# Altium schematic sheet Gate Driver Rectifier.SchDoc
size A4
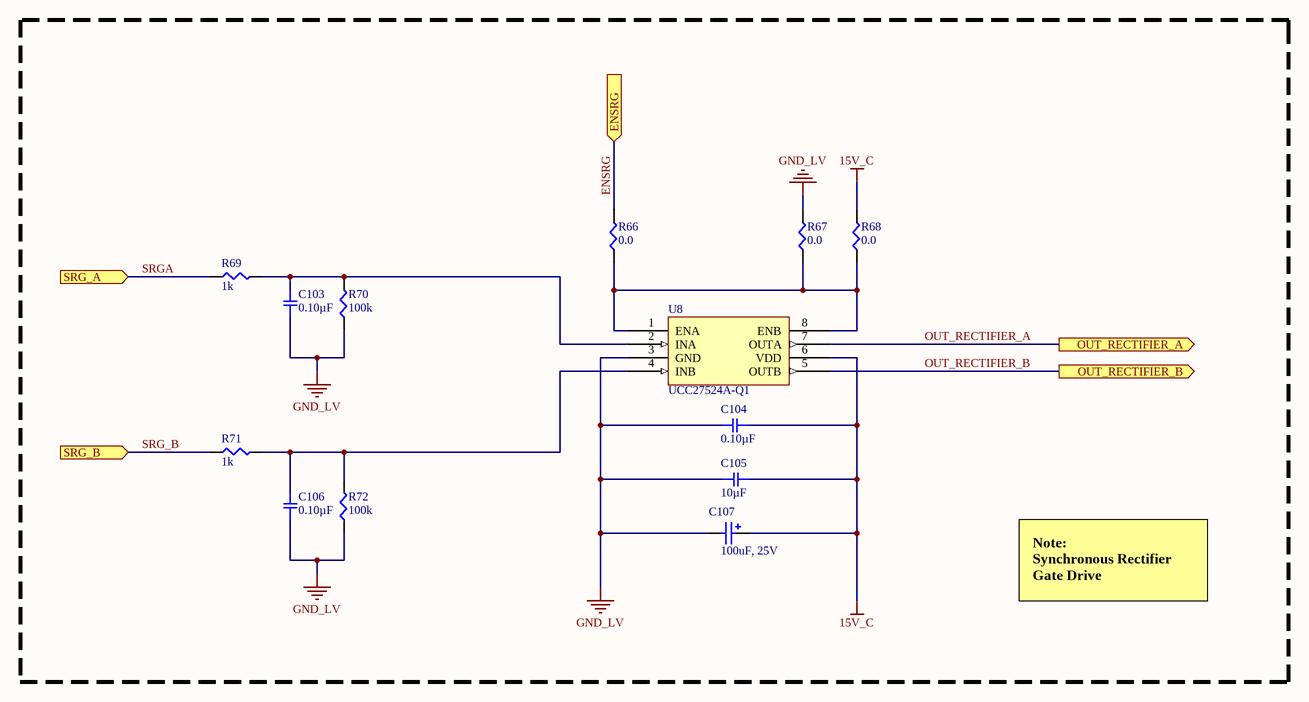
[diagram p0: Gate Driver Rectifier.SchDoc]

## Parts
C103  0.10µF  [SMD-0805C]
C104  0.10µF  [SMD-0805C]
C105  10µF  [SMD-0805C]
C106  0.10µF  [SMD-0805C]
C107  100uF, 25V  [WCAP-ASLL_6.3x7.7]
R66  0.0  [SMD-0603-RES]
R67  0.0  [SMD-0603-RES]
R68  0.0  [SMD-0603-RES]
R69  1k  [SMD-0603-RES]
R70  100k  [SMD-0603-RES]
R71  1k  [SMD-0603-RES]
R72  100k  [SMD-0603-RES]
U8  UCC27524A-Q1  [SOIC127P570X175_HS-9N]

## Ports
ENSRG (in), OUT_RECTIFIER_A (out), OUT_RECTIFIER_B (out), SRG_A (in), SRG_B (in)

## Nets
15V_C: C104.1 C105.2 C107.2(P) R68.2 U8.6(VDD)
GND_LV: C103.1 C104.2 C105.1 C106.1 C107.1(N) R67.2 R70.1 R72.1 U8.3(GND)
ENSRG: R66.2 ; port ENSRG
OUT_RECTIFIER_A: U8.7(OUTA) ; port OUT_RECTIFIER_A
OUT_RECTIFIER_B: U8.5(OUTB) ; port OUT_RECTIFIER_B
SRG_B: R71.1 ; port SRG_B
SRGA: R69.1 ; port SRG_A
NetC103_2: C103.2 R69.2 R70.2 U8.2(INA)
NetC106_2: C106.2 R71.2 R72.2 U8.4(INB)
NetR66_1: R66.1 R67.1 R68.1 U8.1(ENA) U8.8(ENB)

## Notes on the sheet
- Note:
  Synchronous Rectifier Gate Drive

## Library data of the parts
C103 C104 C106 = GCD21BR71H104KA01L: CAP CER 0.1UF 50V X7R 0805; Manufacturer: Murata Electronics North America; Factory Stock: 0; Unit Price (USD): 0.24; Minimum Quantity: 1; Tolerance: ±10%; Datasheets: http://www.murata.com/~/media/webrenewal/support/library/catalog/products/capacitor/mlcc/c03e.ashx; Image: //media.digikey.com/Renders/Murata%20Renders/0805%28GxM6%29.jpg; Digi-Key Part Number: 490-11955-1-ND; Part Number: GCD21BR71H104KA01L; Quantity Available: 157; @ qty: 0; Packaging: Cut Tape (CT); Series: GCD; Part Status: Active; Value: 0.10µF; Voltage: 50V; Temperature Coefficient: X7R; Operating Temperature: -55°C ~ 125°C; Features: -; Ratings: AEC-Q200; Applications: Automotive; Mounting Type: Surface Mount, MLCC; Package / Case: 0805 (2012 Metric); Size / Dimension: 0.079" L x 0.049" W (2.00mm x 1.25mm); Height - Seated (Max): -; Thickness (Max): 0.049" (1.25mm); Lead Spacing: -; Lead Style: -
C105 = GRM21BC8YA106KE11L: CAP CER 10UF 35V X6S 0805; Manufacturer: Murata Electronics North America; Factory Stock: 0; Unit Price (USD): 0.33; Minimum Quantity: 1; Tolerance: ±10%; Datasheets: http://www.murata.com/~/media/webrenewal/support/library/catalog/products/capacitor/mlcc/c02e.pdf; Image: //media.digikey.com/Renders/Murata%20Renders/0805%20(2012%20Metric)%20.85mm.jpg; Digi-Key Part Number: 490-10504-1-ND; Part Number: GRM21BC8YA106KE11L; Quantity Available: 72253; @ qty: 0; Packaging: Cut Tape (CT); Series: GRM; Part Status: Active; Value: 10µF; Voltage: 35V; Temperature Coefficient: X6S; Operating Temperature: -55°C ~ 105°C; Features: Derating Recommended; Ratings: -; Applications: General Purpose; Mounting Type: Surface Mount, MLCC; Package / Case: 0805 (2012 Metric); Size / Dimension: 0.079" L x 0.049" W (2.00mm x 1.25mm); Height - Seated (Max): -; Thickness (Max): 0.057" (1.45mm); Lead Spacing: -; Lead Style: -
C107 = 865060445005: WCAP-ASLL SMT Aluminum Electrolytic Capacitors, D6.3mm x L7.7mm, 100uF, +/-20%, 25VDC; Dissipation Factor: 14%; Endurance: 2000h; Leakage Current: 25uA; Ripple Current max.: 300mA; Technical Reference: ASED077101M025DVCTCB000; ComponentLink1Description: Manufacturer; ComponentLink1URL: http://www.we-online.de; ComponentLink2Description: Datasheet; ComponentLink2URL: https://katalog.we-online.com/pbs/datasheet/865060445005.pdf; Length: 7.7mm; Mounting Technology: SMT; Operating Temperature: -55 to +105degC; Packaging: Tape and Reel; Published Date: August 2019; Capacitance: 100uF; Diameter: 6.3mm; Part Number: 865060445005; Publisher: Wurth Elektronik; Capacitance Tolerance: +/-20%; Rated Voltage: 25VDC
R66-R68 = ERJ-3GEY0R00V: RES SMD 0.0OHM JUMPER 1/10W 0603; Manufacturer: Panasonic Electronic Components; Factory Stock: 0; Unit Price (USD): 0.00352; @ qty: 1500; Minimum Quantity: 1; Power (Watts): 0.1W, 1/10W; Part Number: ERJ-3GEY0R00V; Datasheets: http://industrial.panasonic.com/www-cgi/jvcr13pz.cgi?E+PZ+3+AOA0001+ERJ3GEY0R00V+7+WW; Image: //media.digikey.com/Photos/Panasonic%20Photos/MFG_ERJ-P6W%20Series.jpg; Digi-Key Part Number: P0.0GCT-ND; Quantity Available: 4813372; Packaging: Cut Tape (CT); Series: ERJ; Part Status: Active; Value: 0.0; Tolerance: Jumper; Composition: Thick Film; Features: Automotive AEC-Q200; Temperature Coefficient: -; Operating Temperature: -55°C ~ 155°C; Package / Case: 0603 (1608 Metric); Supplier Device Package: 0603; Size / Dimension: 0.063" L x 0.031" W (1.60mm x 0.80mm); Height - Seated (Max): 0.022" (0.55mm); Number of Terminations: 2; Failure Rate: -
R69 R71 = ERJ-3EKF1001V: RES SMD 1K OHM 1% 1/10W 0603; Manufacturer: Panasonic Electronic Components; Factory Stock: 0; Unit Price (USD): 0.00379; @ qty: 1500; Minimum Quantity: 1; Power (Watts): 0.1W, 1/10W; Temperature Coefficient: ±100ppm/°C; Part Number: ERJ-3EKF1001V; Datasheets: http://industrial.panasonic.com/www-cgi/jvcr13pz.cgi?E+PZ+3+AOA0002+ERJ3EKF1001V+7+WW; Image: //media.digikey.com/Photos/Panasonic%20Photos/MFG_ERJ-P6W%20Series.jpg; Digi-Key Part Number: P1.00KHCT-ND; Quantity Available: 5218845; Packaging: Cut Tape (CT); Series: ERJ; Part Status: Active; Value: 1k; Tolerance: ±1%; Composition: Thick Film; Features: Automotive AEC-Q200; Operating Temperature: -55°C ~ 155°C; Package / Case: 0603 (1608 Metric); Supplier Device Package: 0603; Size / Dimension: 0.063" L x 0.031" W (1.60mm x 0.80mm); Height - Seated (Max): 0.022" (0.55mm); Number of Terminations: 2; Failure Rate: -
R70 R72 = ERJ-3EKF1003V: RES SMD 100K OHM 1% 1/10W 0603; Manufacturer: Panasonic Electronic Components; Factory Stock: 0; Unit Price (USD): 0.00379; @ qty: 1500; Minimum Quantity: 1; Power (Watts): 0.1W, 1/10W; Temperature Coefficient: ±100ppm/°C; Part Number: ERJ-3EKF1003V; Datasheets: http://industrial.panasonic.com/www-cgi/jvcr13pz.cgi?E+PZ+3+AOA0002+ERJ3EKF1003V+7+WW; Image: //media.digikey.com/Photos/Panasonic%20Photos/MFG_ERJ-P6W%20Series.jpg; Digi-Key Part Number: P100KHCT-ND; Quantity Available: 2179804; Packaging: Cut Tape (CT); Series: ERJ; Part Status: Active; Value: 100k; Tolerance: ±1%; Composition: Thick Film; Features: Automotive AEC-Q200; Operating Temperature: -55°C ~ 155°C; Package / Case: 0603 (1608 Metric); Supplier Device Package: 0603; Size / Dimension: 0.063" L x 0.031" W (1.60mm x 0.80mm); Height - Seated (Max): 0.022" (0.55mm); Number of Terminations: 2; Failure Rate: -
U8 = UCC27524A